# EasyEDA schematic LFR_Body_Circuit.json
TITLE: Sheet_1; REV: 1.0; Date: 2025-21-12; Sheet: 1/1; Drawn By: Razee; Company: Your Company
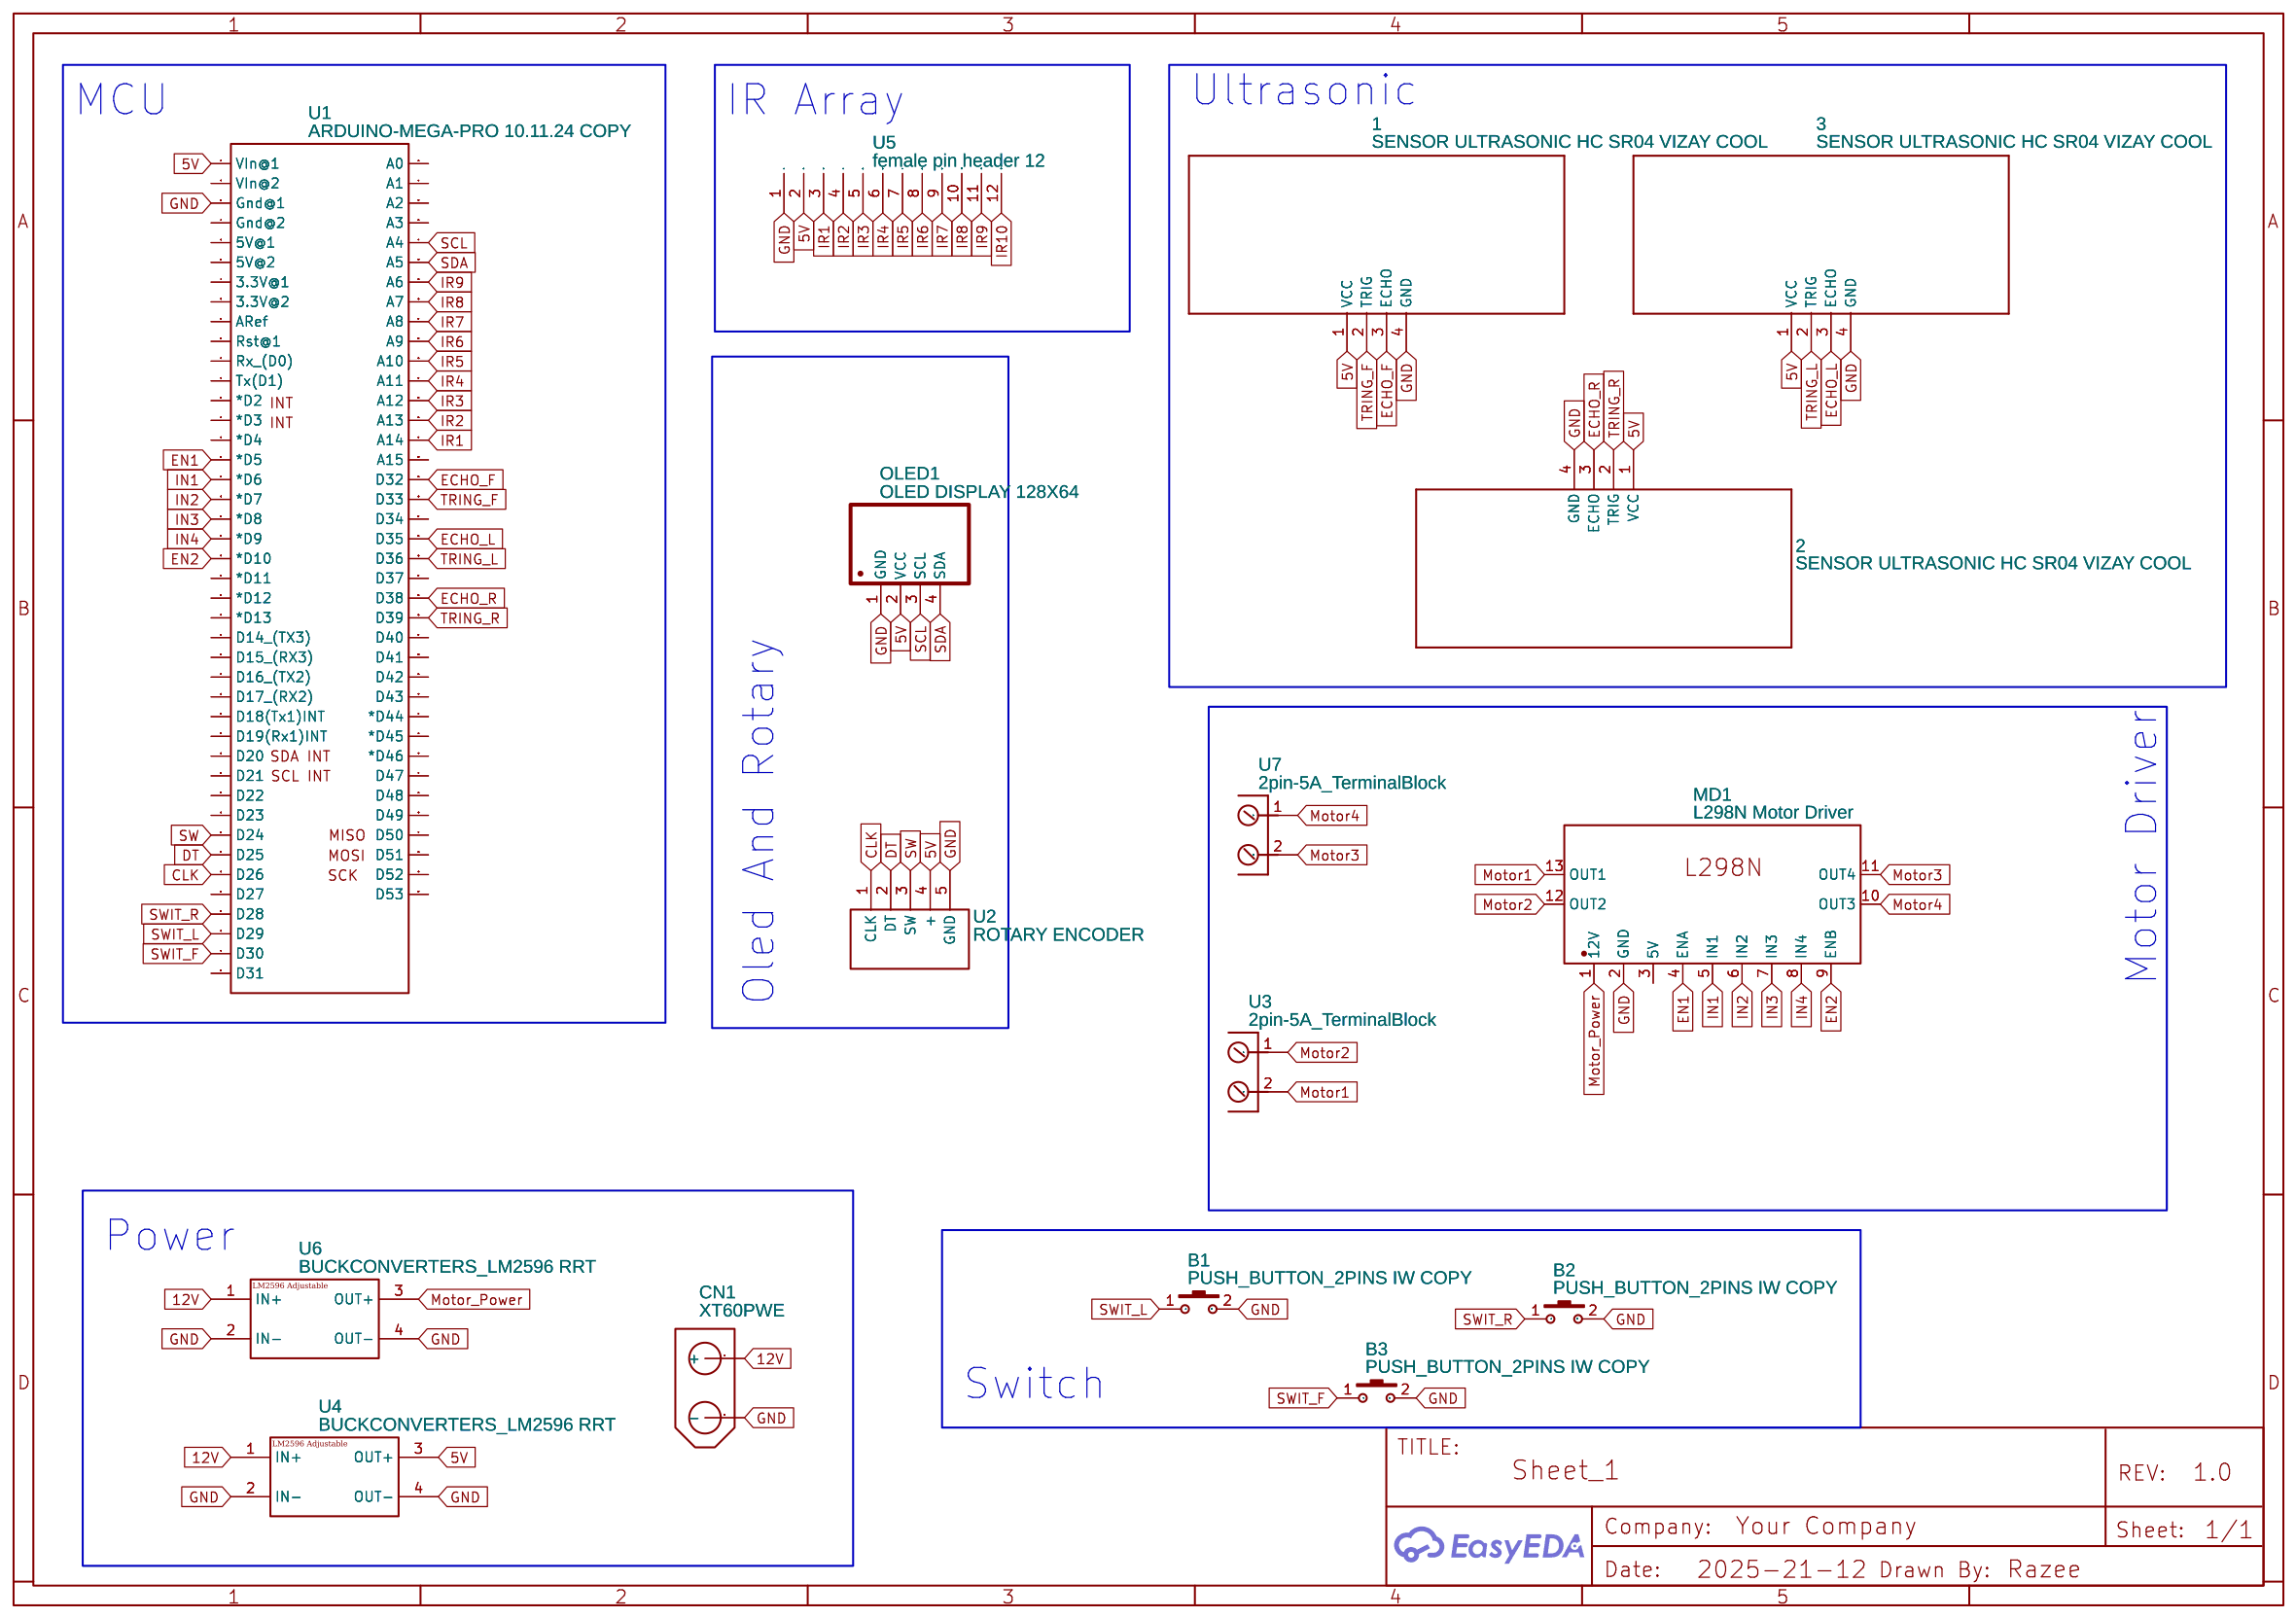
[diagram p0: schematic sheet]

## Parts
1  SENSOR ULTRASONIC HC SR04 VIZAY COOL  [ULTRASONIC-HC-SR04]
2  SENSOR ULTRASONIC HC SR04 VIZAY COOL  [ULTRASONIC-HC-SR04]
3  SENSOR ULTRASONIC HC SR04 VIZAY COOL  [ULTRASONIC-HC-SR04]
B1  PUSH_BUTTON_2PINS IW COPY  [R 5W COPY COPY COPY COPY COPY]
B2  PUSH_BUTTON_2PINS IW COPY  [R 5W COPY COPY COPY COPY COPY]
B3  PUSH_BUTTON_2PINS IW COPY  [R 5W COPY COPY COPY COPY COPY]
CN1  XT60PWE  [CONN-TH_XT60UPB-M COPY]
MD1  L298N Motor Driver  [L298N MOTOR DRIVER]
OLED1  OLED DISPLAY 128X64  [0.96-OLED-DISPLAY]
U1  ARDUINO-MEGA-PRO 10.11.24 COPY  [ARDUINO-MEGA-PRO-MINI]
U2  ROTARY ENCODER  [ROTARYENCODER]
U3  2pin-5A_TerminalBlock  [5A_2PIN-TERMINALBLOCK]
U4  BUCKCONVERTERS_LM2596 RRT  [LM2596:YAAJ_DCDC_STEPDOWN_LM2596]
U5  female pin header 12  [FEMALE PIN HEADER 12PIN]
U6  BUCKCONVERTERS_LM2596 RRT  [LM2596:YAAJ_DCDC_STEPDOWN_LM2596]
U7  2pin-5A_TerminalBlock  [5A_2PIN-TERMINALBLOCK]

## Library data of the parts
1-3 = SENSOR ULTRASONIC HC SR04 VIZAY COOL: Contributor: hollandacocobear
B1-B3 = PUSH_BUTTON_2PINS IW COPY: Manufacturer Part: PUSH_BUTTON_2Pini; Contributor: MinnKhantKyaw
CN1 = XT60 COPY COPY: Supplier: LCSC; Supplier Part: C98732; Manufacturer: Changzhou Amass Elec
MD1 = L298N Motor Driver: Contributor: KC
OLED1 = OLED DISPLAY 128X64: Contributor: iloveelectronics
U1 = ARDUINO-MEGA-PRO 10.11.24 COPY: Manufacturer Part: ARDUINO MEGA 2560 PRO EMBED; Contributor: Tony Sloos; subpart_no: 1
U2 = ROTARY ENCODER: Contributor: ugursefayalcindag
U3 U7 = 2pin-5A_TerminalBlock: Contributor: Christel_Peeris
U4 U6 = BuckConverters_LM2596_Adj: Servo 5V; Add into BOM: yes; Convert to PCB: yes; Origin Footprint: YAAJ_DCDC_StepDown_LM2596; Contributor: dirasuryakadek
U5 = female pin header 12: Manufacturer Part: New SchematicLib; Contributor: zsteva

## Nets
5V: 1.1(VCC) 2.1(VCC) 3.1(VCC) OLED1.2(VCC) U1.1(VIn@1) U2.4(+) U4.3(OUT+) U5.2
12V: CN1.1(+) U4.1(IN+) U6.1(IN+)
GND: 1.4(GND) 2.4(GND) 3.4(GND) B1.2 B2.2 B3.2 CN1.2(-) MD1.2(GND) OLED1.1(GND) U1.3(Gnd@1) U2.5(GND) U4.2(IN-) U4.4(OUT-) U5.1 U6.2(IN-) U6.4(OUT-)
CLK: U1.37(D26) U2.1(CLK)
DT: U1.36(D25) U2.2(DT)
ECHO_F: 1.3(ECHO) U1.59(D32)
ECHO_L: 3.3(ECHO) U1.62(D35)
ECHO_R: 2.3(ECHO) U1.65(D38)
EN1: MD1.4(ENA) U1.16(*D5)
EN2: MD1.9(ENB) U1.21(*D10)
IN1: MD1.5(IN1) U1.17(*D6)
IN2: MD1.6(IN2) U1.18(*D7)
IN3: MD1.7(IN3) U1.19(*D8)
IN4: MD1.8(IN4) U1.20(*D9)
IR1: U1.57(A14) U5.3
IR2: U1.56(A13) U5.4
IR3: U1.55(A12) U5.5
IR4: U1.54(A11) U5.6
IR5: U1.53(A10) U5.7
IR6: U1.52(A9) U5.8
IR7: U1.51(A8) U5.9
IR8: U1.50(A7) U5.10
IR9: U1.49(A6) U5.11
IR10: U5.12
Motor1: MD1.13(OUT1) U3.2
Motor2: MD1.12(OUT2) U3.1
Motor3: MD1.11(OUT4) U7.2
Motor4: MD1.10(OUT3) U7.1
Motor_Power: MD1.1(12V) U6.3(OUT+)
SCL: OLED1.3(SCL) U1.47(A4)
SDA: OLED1.4(SDA) U1.48(A5)
SW: U1.35(D24) U2.3(SW)
SWIT_F: B3.1 U1.41(D30)
SWIT_L: B1.1 U1.40(D29)
SWIT_R: B2.1 U1.39(D28)
TRING_F: 1.2(TRIG) U1.60(D33)
TRING_L: 3.2(TRIG) U1.63(D36)
TRING_R: 2.2(TRIG) U1.66(D39)

Not connected (* = marked no-connect by the designer): MD1 3(5V); U1 2(VIn@2) 4(Gnd@2) 5(5V@1) 6(5V@2) 7(3.3V@1) 8(3.3V@2) 9(ARef) 10(Rst@1) 11(Rx (D0)) 12(Tx(D1)) 13(*D2) 14(*D3) 15(*D4) 22(*D11) 23(*D12) 24(*D13) 25(D14 (TX3)) 26(D15 (RX3)) 27(D16 (TX2)) 28(D17 (RX2)) 29(D18(Tx1)INT) 30(D19(Rx1)INT) 31(D20) 32(D21) 33(D22) 34(D23) 38(D27) 42(D31) 43(A0) 44(A1) 45(A2) 46(A3) 58(A15) 61(D34) 64(D37) 67(D40) 68(D41) 69(D42) 70(D43) 71(*D44) 72(*D45) 73(*D46) 74(D47) 75(D48) 76(D49) 77(D50) 78(D51) 79(D52) 80(D53)

## Notes on the sheet
- MCU
- IR Array
- Ultrasonic
- Motor Driver
- Oled And Rotary
- Power
- Switch
